# Altium schematic sheet ems.SchDoc: TITLE
size A4; Author: AUTHOR; Organization: Develer s.r.l.; Address1: via Mugellese 1/A; Address2: 50019 Campi Bisenzio; Address3: Firenze; Address4: ITALY; Revision: A; SheetNumber: 1; SheetTotal: 1; Hw_rev: R1
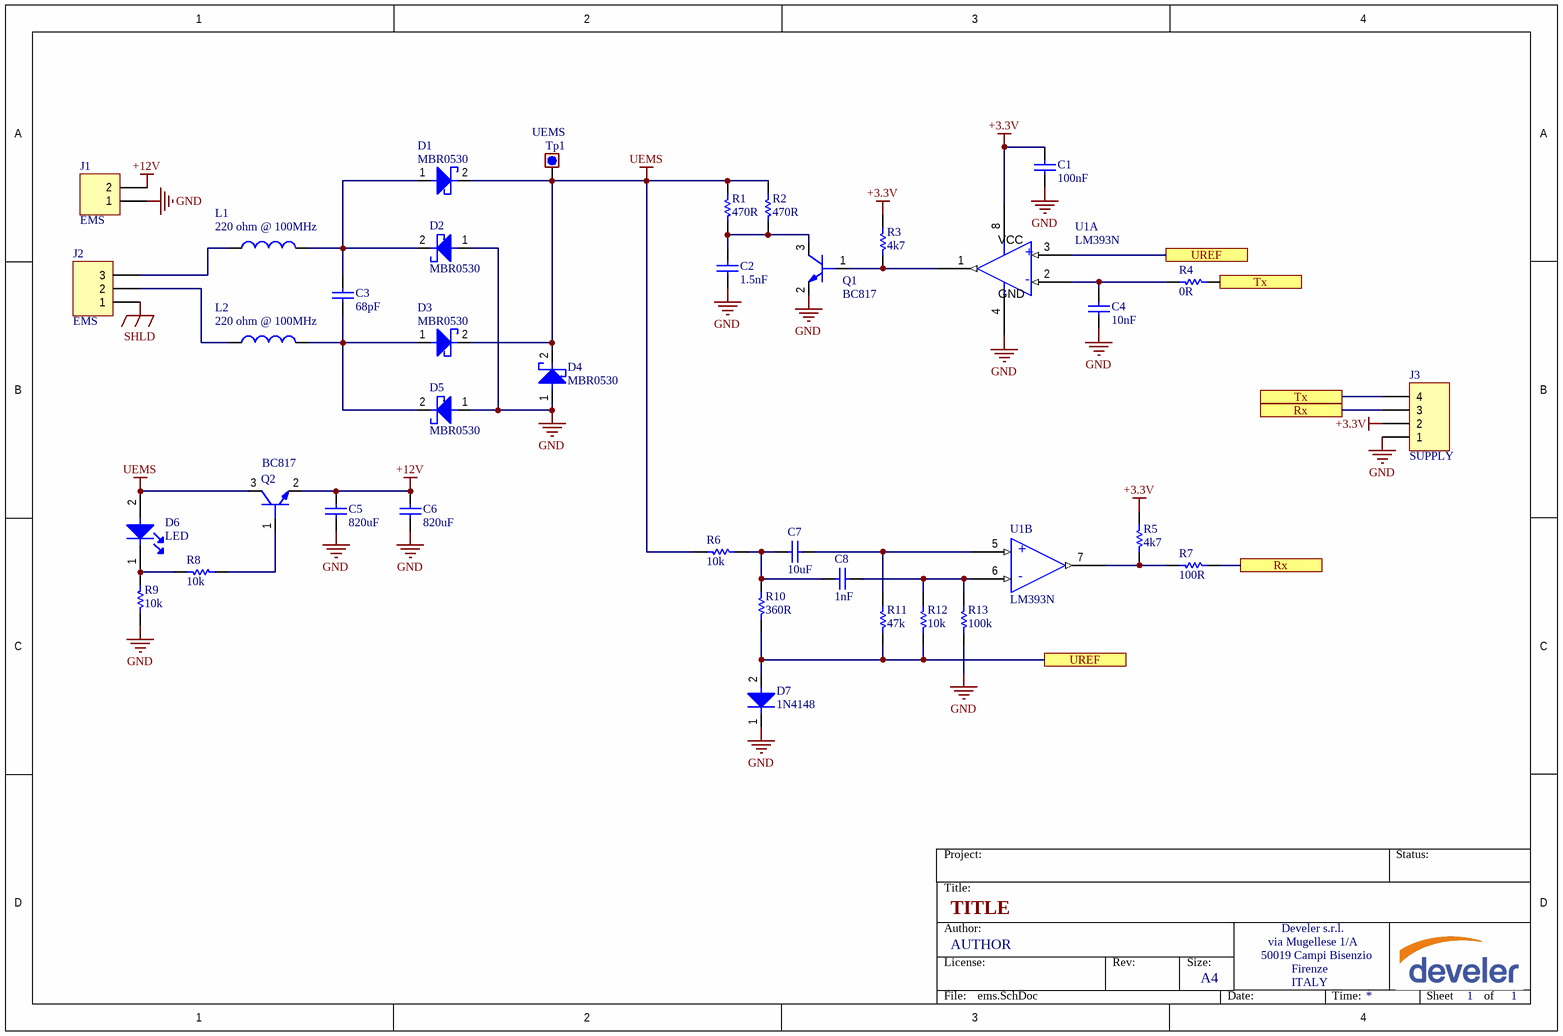
[diagram p0: ems.SchDoc]

## Parts
C1  100nF  [0603_[1608]]
C2  1.5nF  [0603_[1608]]
C3  68pF  [0603_[1608]]
C4  10nF  [0603_[1608]]
C5  820uF  [CAP_CYL_3.5mm_D8mm]
C6  820uF  [CAP_CYL_3.5mm_D8mm]
C7  10uF  [0603_[1608]]
C8  1nF  [0603_[1608]]
D1  MBR0530  [SOD-123_K2-A1]
D2  MBR0530  [SOD-123_K2-A1]
D3  MBR0530  [SOD-123_K2-A1]
D4  MBR0530  [SOD-123_K2-A1]
D5  MBR0530  [SOD-123_K2-A1]
D6  LED  [1206_[3216]_K1-A2_LED]
D7  1N4148  [SOD-80C]
J1  EMS  [CON_2P_WAGO_3.5mm]
J2  EMS  [CON_3P_WAGO_3.5mm]
J3  SUPPLY  [CON_4P_WAGO_3.5mm]
L1  220 ohm @ 100MHz  [0805_[2012]]
L2  220 ohm @ 100MHz  [0805_[2012]]
Q1  BC817  [SOT-23]
Q2  BC817  [SOT-23]
R1  470R  [0603_[1608]]
R2  470R  [0603_[1608]]
R3  4k7  [0603_[1608]]
R4  0R  [0603_[1608]]
R5  4k7  [0603_[1608]]
R6  10k  [0603_[1608]]
R7  100R  [0603_[1608]]
R8  10k  [0603_[1608]]
R9  10k  [0603_[1608]]
R10  360R  [0603_[1608]]
R11  47k  [0603_[1608]]
R12  10k  [0603_[1608]]
R13  100k  [0603_[1608]]
Tp1  UEMS  [TEST_POINT_THD_D1.8MM]  (no BOM)
U1  LM393N  [SOIC8]  (parts A,B of 2)

## Ports
Rx, Tx, UREF

## Nets
+3.3V: C1.2 J3.2 R3.1 R5.1 U1.8(VCC)
+12V: C5.2 C6.2 J1.2 Q2.2(E)
GND: C1.1 C2.1 C4.1 C5.1 C6.1 D2.1(A) D4.1(A) D5.1(A) D7.1(K) J1.1 J3.1 Q1.2(E) R9.1 R13.1 U1.4(GND)
SHLD: J2.1
UEMS: D1.2(K) D3.2(K) D4.2(K) D6.2(A) Q2.3(C) R1.1 R2.1 R6.1 Tp1.1
Rx: J3.3 R7.2 ; port Rx
Tx: J3.4 R4.2 ; port Tx
UREF: D7.2(A) R10.1 R11.1 R12.1 U1.3(IN+) ; port UREF
NetC2_2: C2.2 Q1.3(C) R1.2 R2.2
NetC3_1: C3.1 D3.1(A) D5.2(K) L2.1
NetC3_2: C3.2 D1.1(A) D2.2(K) L1.1
NetC4_2: C4.2 R4.1 U1.2(IN-)
NetC7_1: C7.1 R11.2 U1.5(IN+)
NetC7_2: C7.2 C8.2 R6.2 R10.2
NetC8_1: C8.1 R12.2 R13.2 U1.6(IN-)
NetD6_1: D6.1(K) R8.2 R9.2
NetJ2_2: J2.2 L2.2
NetJ2_3: J2.3 L1.2
NetQ1_1: Q1.1(B) R3.2 U1.1(OUT)
NetQ2_1: Q2.1(B) R8.1
NetR5_2: R5.2 R7.1 U1.7(OUT)

## Notes on the sheet
- Title:
- Project:
- Status:
- Author:
- License:
- Rev:
- Size:
- A4
- File:
- Date:
- Time:
- Sheet
- of
- (in symbol LM358, part A) +; -
- (in symbol LM358, part B) +; -

## Library data of the parts
C1-C8 = Cap: Ceramic X7R 50V; Value: 100pF; Published: 8-Jun-2000; LatestRevisionDate: 17-Jul-2002; LatestRevisionNote: Re-released for DXP Platform.; PackageReference: RAD-0.3; Publisher: Altium Limited; PackageDescription: Radial Cap, Thru-Hole; 2 Leads; 0.3 in Pin Spacing
D1-D5 = Diode_SCHOTTKY: Schottky Diodes
D6 = LED: Multicolor LED
D7 = Diode
J1 = Header 2: Header, 2-Pin; LatestRevisionDate: 17-Jul-2002; LatestRevisionNote: Re-released for DXP Platform.; Publisher: Altium Limited
J2 = Header 3: Header, 3-Pin; LatestRevisionDate: 17-Jul-2002; LatestRevisionNote: Re-released for DXP Platform.; Publisher: Altium Limited
J3 = Header 4: Header, 4-Pin; LatestRevisionDate: 17-Jul-2002; LatestRevisionNote: Re-released for DXP Platform.; Publisher: Altium Limited
L1 L2 = Inductor: WE 742792022
Q1 Q2 = BC817: BJT NPN
R1-R13 = Res1: Resistor; Value: 1K; Published: 8-Jun-2000; Revision: July-2002: Re-released for DXP Platform.; Publisher: Altium Limited
Tp1 = Test_point: Test point
U1 = LM358: Op Amp.